# EAGLE design node3 (EAGLE 8.5.1)
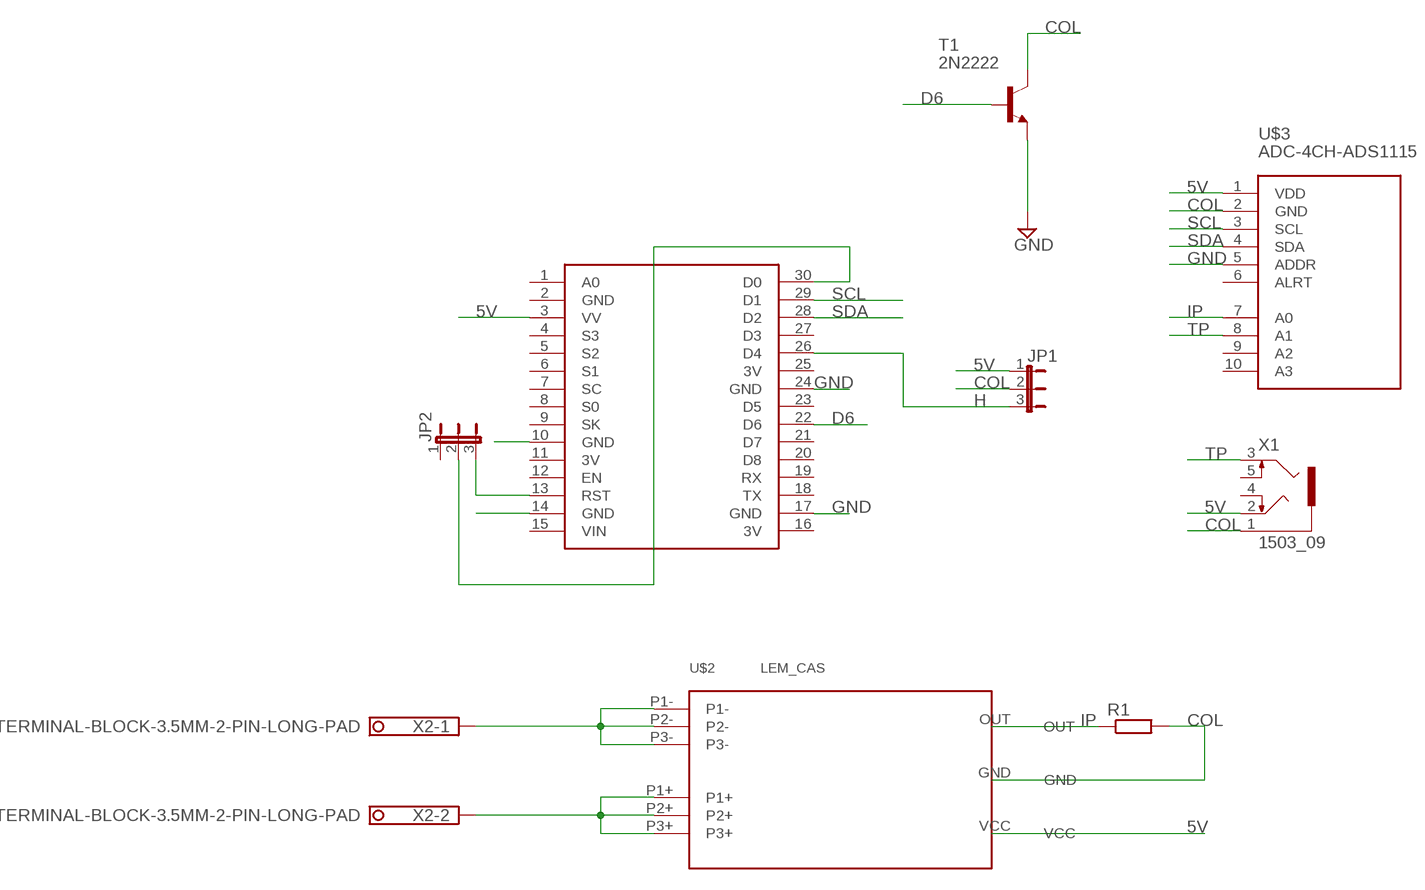
[diagram p0: schematic, sheet 1]

## Parts
JP1  JP2E  [JP2]
JP2  JP2E  [JP2]
R1  R-EU_0207/10  [0207/10]
T1  2N2222  [TO18]
U$1  NODEMCU  [NODEMCU]
U$2  LEM_CAS  [LEMCAS]
U$3  ADC-4CH-ADS1115  [ADC-4CH-ADS1115]
X1  1503_09  [1503_09]
X2  TERMINAL-BLOCK-3.5MM-2-PIN-LONG-PAD  [TERMINAL-BLOCK-2-PIN-3.5MM-LONG-PAD]

## Nets
5V: JP1.1 U$1.3(VV) U$2.VCC U$3.1(VDD) X1.2
COL: JP1.2 R1.2 T1.3(C) U$2.GND U$3.2(GND) X1.1
D6: T1.2(B) U$1.22(D6)
GND: T1.1(E) U$1.10(GND) U$1.14(GND) U$1.17(GND) U$1.24(GND) U$3.5(ADDR)
H: JP1.3 U$1.26(D4)
IN: U$2.P1- U$2.P2- U$2.P3- X2.1
IP: R1.1 U$2.OUT U$3.7(A0)
N$6: JP2.3 U$1.13(RST)
N$7: JP2.2 U$1.30(D0)
OUT: U$2.P1+ U$2.P2+ U$2.P3+ X2.2
SCL: U$1.29(D1) U$3.3(SCL)
SDA: U$1.28(D2) U$3.4(SDA)
TP: U$3.8(A1) X1.3
Unconnected: JP2.1 U$1.1(A0) U$1.4(S3) U$1.5(S2) U$1.6(S1) U$1.7(SC) U$1.8(S0) U$1.9(SK) U$1.12(EN) U$1.15(VIN) U$1.18(TX) U$1.19(RX) U$1.20(D8) U$1.21(D7) U$1.23(D5) U$1.27(D3) U$3.6(ALRT) U$3.9(A2) U$3.10(A3) X1.4 X1.5

## Power pins joined to a net without a drawn wire
3V: U$1.11(3V) U$1.16(3V) U$1.25(3V)
GND: U$1.2(GND)

## Library data of the parts
JP1 JP2 = jumper:JP2E: JUMPER
R1 = rcl:R-EU_: RESISTOR, European symbol; SPICEPREFIX: R
T1 = transistor:2N2222: NPN TRANSISTOR
U$1 = nodemcu:NODEMCU
U$2 = LEM_CAS:LEM_CAS
U$3 = diy-modules:ADC-4CH-ADS1115: 4 Channel 16-Bit Analog-to-Digital Converter based on ADS1115 chip Arduino ADS1115 Getting Started Tutorial is available here: http://henrysbench.capnfatz.com/henrys-bench/arduino-voltage-measurements/arduino-ads1115-module-getting-started-tutorial/ ADS1115 datasheet is available here: http://www.ti.com/lit/ds/symlink/ads1115.pdf Click here to find device on ebay.com <http://www.ebay.com/sch/ads1115+module>
X1 = con-lumberg:1503_09: Jack connectors according to JISC 6560, 3.5 mm Klinkeneinbaukupplung nach JISC 6560, 3,5 mm, 3-polig/ stereo, abgewinkelte Ausführung, mit 2 Öffnern und Lötaugen, für Leiterplatten Rückseitenmontage Source: http://www.lumberg.com/Produkte/PDFs/1503_09.pdf; OC_FARNELL: 1243244; OC_NEWARK: unknown
X2 = Rembrandt Electronics - Terminal Block 3-5mm v1-0:TERMINAL-BLOCK-3.5MM-2-PIN: Terminal Block 3.5mm Pitch: 3,5 mm Number of pins: 2 Created by Rembrandt Electronics www.rembrandtelectronics.com

## Board
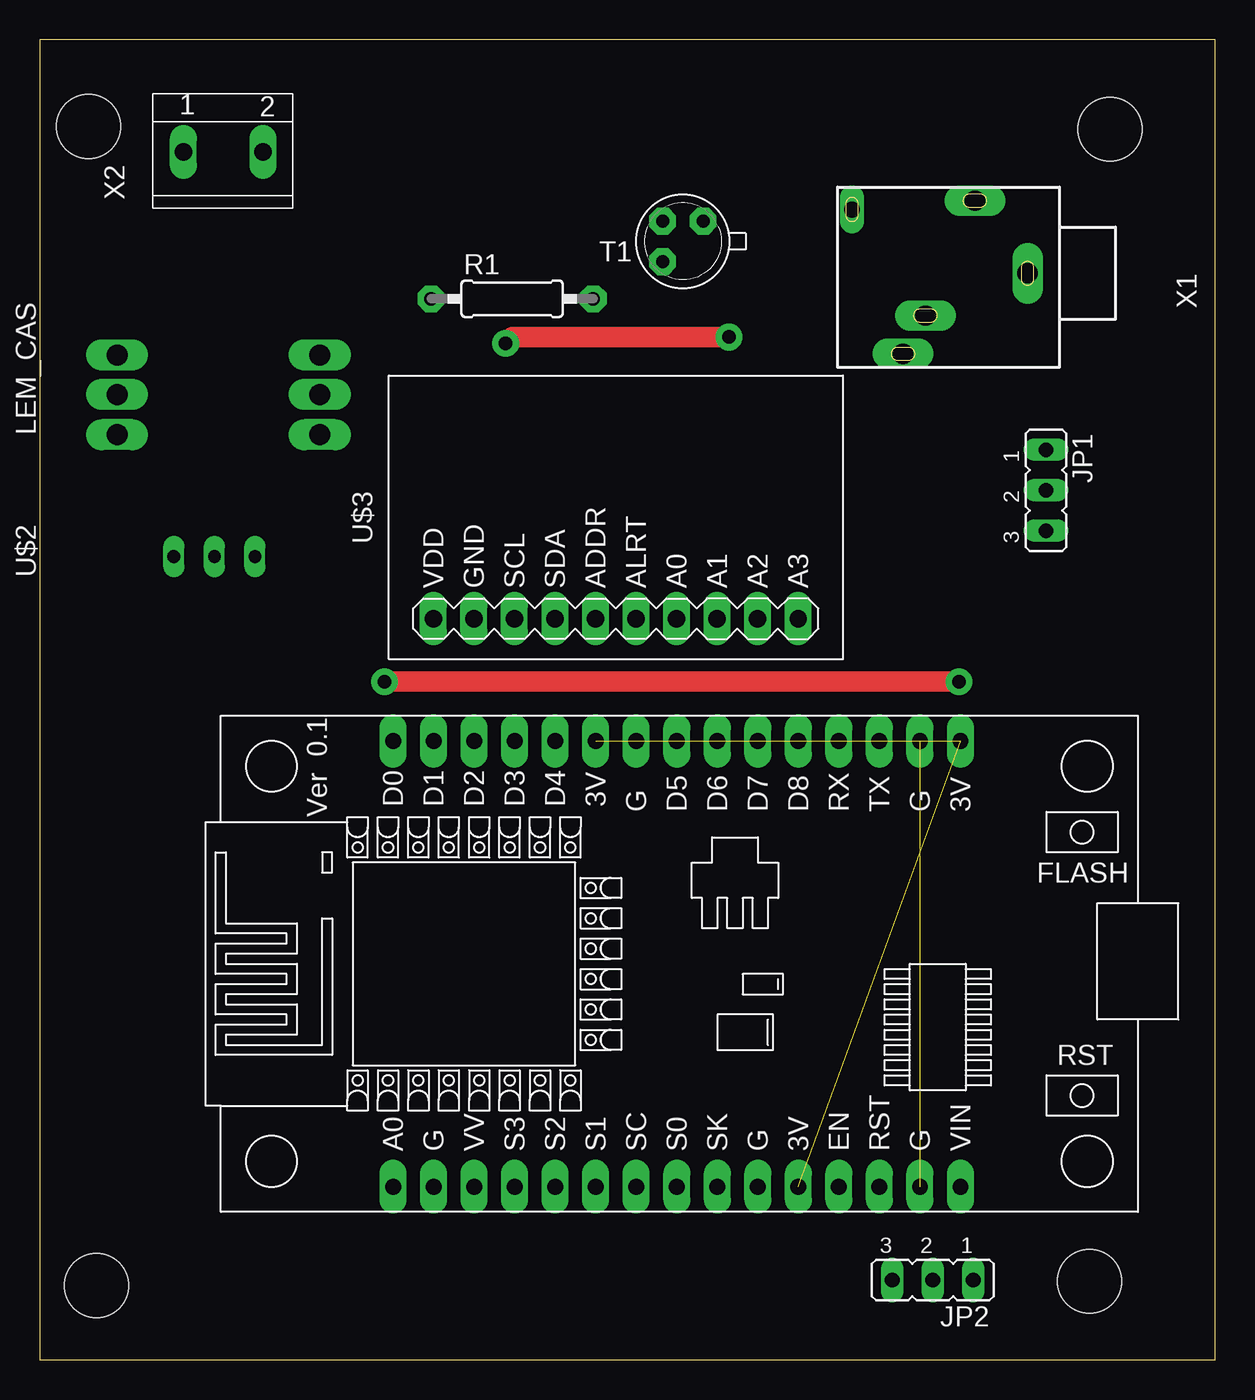
[diagram p1: board, top side]
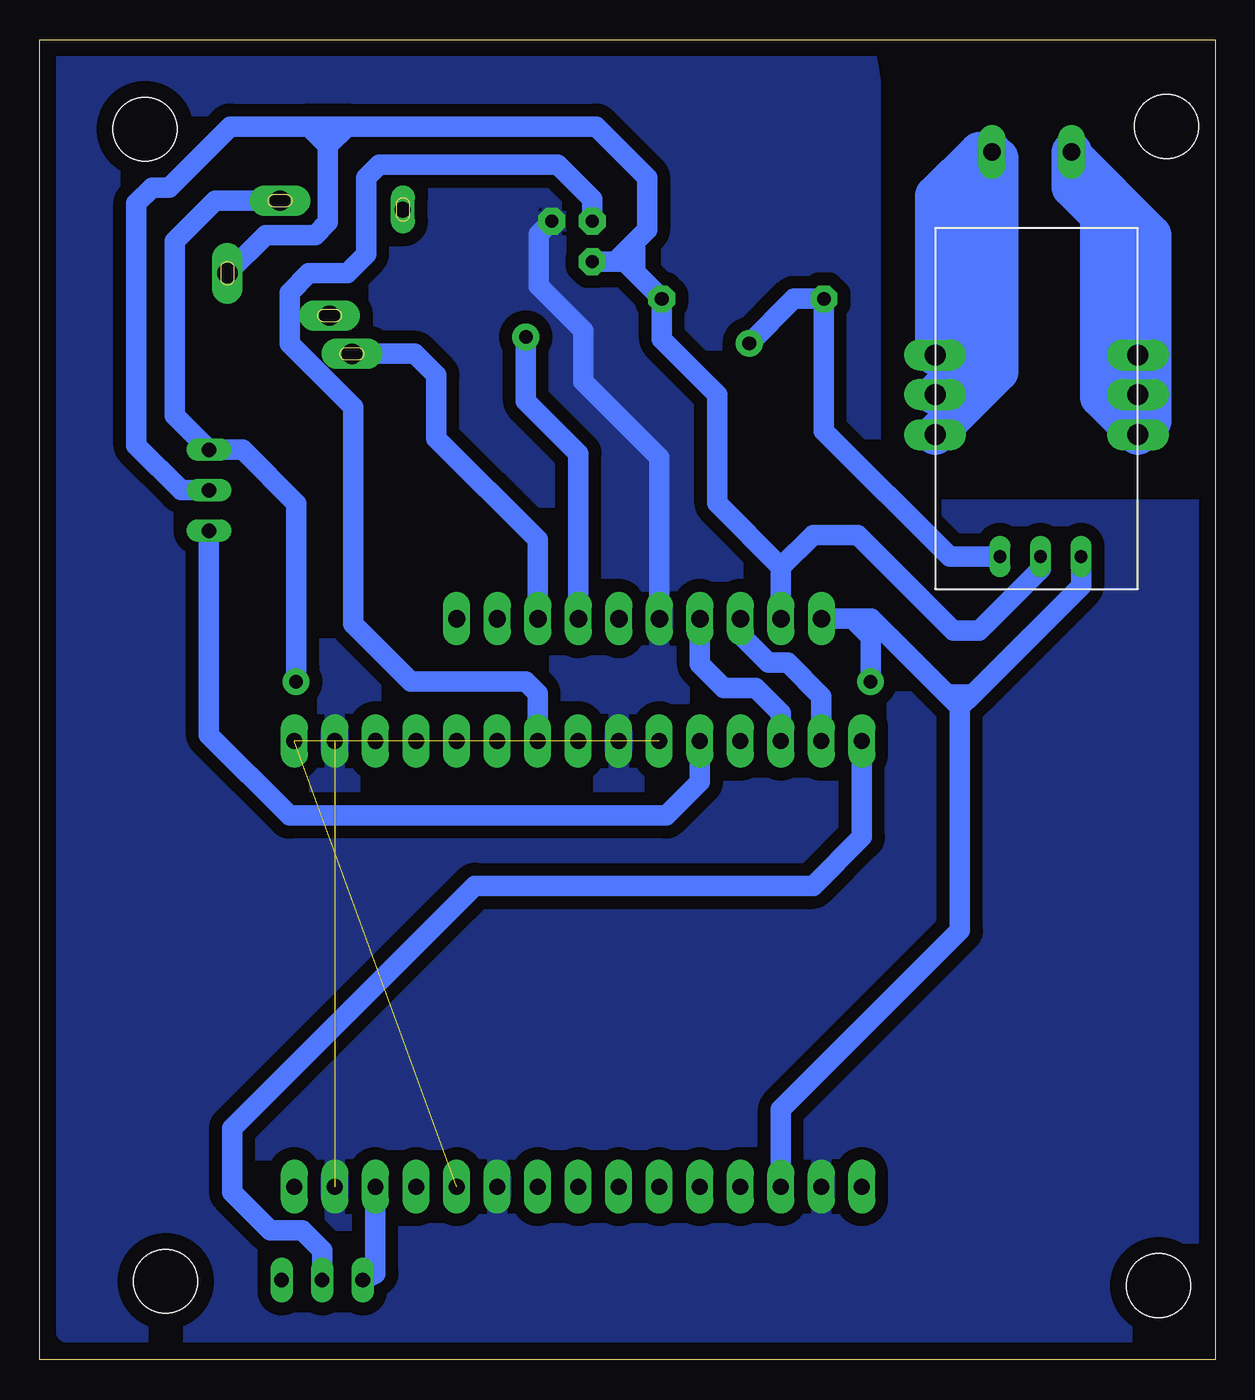
[diagram p2: board, bottom side, seen from below]

Size 73.64 x 82.73 mm. Coordinates in mm from the lower left corner, seen from the top.
Outline: 0,0 73.64,0 73.64,82.73 0,82.73 0,0
Copper layers (1*16): Top 0.035mm / dielectric 1.5mm / Bottom 0.035mm
Design rules "default": minimum track width 6mil, minimum drill 0.35mm, track to track 6mil, track to pad 6mil, pad to pad 6mil, via to via 6mil, smd to smd 6mil, copper to edge 40mil, drill to drill 6mil, minimum pad ring 10mil, minimum via ring 8mil, stop-mask expansion 4mil, vias tented up to drill 0mil, thermal gap 10mil
Holes 4 mm at 3.54,4.64 65.76,4.91 3.04,77.3 67.06,77.13

### Footprints (pad centres in the part's own frame; a part is rotated, then mirrored left to right if it is on the bottom)
JP2 = drill 0.914 long: 1 -2.54,0; 2 0,0; 3 2.54,0
0207/10 = drill 0.85 pad 1.676 octagon: 1 -5.08,0; 2 5.08,0
TO18 = drill 0.813 pad 1.676 octagon: 1 -1.27,-1.27; 2 1.27,-1.27; 3 1.27,1.27
NODEMCU = drill 1 pad 1.676 long: 1 -13.97,17.78; 2 -13.97,15.24; 3 -13.97,12.7; 4 -13.97,10.16; 5 -13.97,7.62; 6 -13.97,5.08; 7 -13.97,2.54; 8 -13.97,0; 9 -13.97,-2.54; 10 -13.97,-5.08; 11 -13.97,-7.62; 12 -13.97,-10.16; 13 -13.97,-12.7; 14 -13.97,-15.24; 15 -13.97,-17.78; 16 13.97,-17.78; 17 13.97,-15.24; 18 13.97,-12.7; 19 13.97,-10.16; 20 13.97,-7.62; 21 13.97,-5.08; 22 13.97,-2.54; 23 13.97,0; 24 13.97,2.54; 25 13.97,5.08; 26 13.97,7.62; 27 13.97,10.16; 28 13.97,12.7; 29 13.97,15.24; 30 13.97,17.78
LEMCAS = drill 0.8 pad 1.27 long: GND -10.16,0.254; OUT -10.16,-2.286; VCC -10.16,2.794 | drill 1.3 pad 1.93 long: P1+ -2.52,-6.35; P1- -2.52,6.35; P2+ 0,-6.35; P2- 0,6.35; P3+ 2.47,-6.35; P3- 2.47,6.35
ADC-4CH-ADS1115 = drill 1.092 pad 1.676 long: 1 -6.35,11.43; 2 -6.35,8.89; 3 -6.35,6.35; 4 -6.35,3.81; 5 -6.35,1.27; 6 -6.35,-1.27; 7 -6.35,-3.81; 8 -6.35,-6.35; 9 -6.35,-8.89; 10 -6.35,-11.43
1503_09 = drill 1.27 pad 1.422 long: 1 0,-2.1; 2 -4.55,-5.4; 3 5.05,-9.9; 5 2.65,-8.5 | drill 1 pad 1.016 long: 4 -4,-13.1
TERMINAL-BLOCK-2-PIN-3.5MM-LONG-PAD = drill 1.1 pad 1.7 long: 1 -5,0; 2 0,0

### Placement (x,y rotation side)
JP1  63.05,54.5 270 top
JP2  55.95,4.99 180 top
R1  29.59,66.5 0 top
T1  40.29,70.1 180 top
U$1  39.91,24.81 90 top
U$2  11.19,60.5 90 top
U$3  36.09,52.8 90 top
X1  63.99,68.1 270 top
X2  13.99,75.7 0 top

### Tracks (layer width: path | path; a pad name or v marks a point on that pad's centre or on a via)
3V  (2 unrouted)
5V  (via drill 0.85 pad 1.68)
  Top 1.27: v21.59,42.5 v57.59,42.5
  Bottom 1.27: U$1.3 27.21,15.68 15.99,26.9 15.99,40.9 | 21.54,46.45 22.74,46.45 | 22.74,46.45 U$3.1 | 15.99,40.9 16.79,41.7 | 16.79,41.7 21.54,46.45 | X1.2 62.64,72.65 65.19,70.1 65.19,59.18 JP1.1 60.93,57.04 57.56,53.67 57.56,43.3 57.59,43.27 v57.59,42.5 | U$2.VCC 8.4,48.49 15.19,41.7 | 15.19,41.7 15.99,40.9 | 15.19,41.7 16.79,41.7 | v21.59,42.5 21.59,45.3 | 21.59,45.3 21.59,46.4 21.54,46.45 | 21.59,45.3 22.74,46.45
COL
  Bottom 1.27: 36.33,68.16 R1.2 34.67,63.98 31.19,60.5 31.19,53.68 27.2,49.69 | 36.33,68.16 37,68.83 37.59,68.83 | 37.59,68.83 T1.3 | JP1.2 64.79,54.5 67.59,57.3 67.59,72.5 66.61,73.48 65.55,73.48 61.73,77.3 56.79,77.3 | 56.79,77.3 55.59,77.3 | 55.59,77.3 54.39,77.3 | 54.39,77.3 38.79,77.3 35.59,74.1 35.59,70.83 36.55,69.86 | 36.55,69.86 37.59,68.83 | 36.33,68.16 36.33,69.64 36.55,69.86 | X1.1 59.49,70.5 56.39,70.5 55.59,71.3 55.59,76.1 | 55.59,76.1 55.59,77.3 | 54.39,77.3 55.59,76.1 | 55.59,76.1 56.79,77.3 | U$2.GND 10.94,49.55 14.79,45.7 16.39,45.7 22.39,51.7 25.19,51.7 27.2,49.69 | 27.2,49.69 U$3.2
D6
  Bottom 1.27: U$1.22 42.45,41.76 43.19,42.5 50.39,42.5 53.99,46.1 53.99,59.7 57.99,63.7 57.99,66.9 56.79,68.1 54.39,68.1 53.19,69.3 53.19,74.1 52.39,74.9 41.19,74.9 39.02,72.73 T1.2
GND  (2 unrouted)
  Bottom 1.27: U$3.5 34.82,56.53 39.59,61.3 39.59,64.5 42.39,67.3 42.39,70.54 T1.1
  pour Bottom (isolate 0.813): -0.01,1.7 71.99,1.7 73.19,82.1 21.99,82.5 21.59,80.1 21.59,54.5 20.39,53.3 0.79,53.3 0.79,2.5
H
  Bottom 1.27: U$1.26 32.29,36.2 34.39,34.1 57.99,34.1 63.05,39.16 JP1.3
IN
  Bottom 2.54: X2.1 8.99,75.1 4.84,70.95 U$2.P3- | X2.1 8.99,73.5 7.19,71.7 7.19,62.5 | 7.19,62.5 7.19,60.33 U$2.P1- 3.99,58.83 3.99,61.35 | 3.99,61.35 U$2.P2- 6.39,62.05 6.39,62.1 6.79,62.5 7.19,62.5 | 3.99,61.35 3.99,70.5 8.99,75.5 X2.1
IP  (via drill 0.85 pad 1.68)
  Top 1.27: v43.19,64.1 29.59,64.1 v29.19,63.7
  Bottom 1.27: U$2.OUT 16.63,50.34 24.51,58.22 R1.1 26.39,66.5 v29.19,63.7 | U$3.7 39.9,56.81 43.19,60.1 v43.19,64.1
N$6
  Bottom 1.27: JP2.3 52.61,5.39 U$1.13
N$7
  Bottom 1.27: JP2.2 55.95,6.86 57.19,8.1 59.19,8.1 61.59,10.5 61.59,14.5 46.39,29.7 25.19,29.7 22.13,32.76 U$1.30
OUT
  Bottom 2.54: U$2.P1+ 13.59,61.93 13.59,75.3 | 13.59,75.3 X2.2 | U$2.P3+ 17.54,72.95 14.79,75.7 14.39,75.3 13.59,75.3 | U$2.P2+ 15.19,62.85 15.19,73.7 13.59,75.3
SCL
  Bottom 1.27: U$1.29 24.67,41.58 26.79,43.7 27.99,43.7 29.74,45.45 U$3.3
SDA
  Bottom 1.27: U$1.28 27.21,40.52 28.79,42.1 30.79,42.1 32.28,43.59 U$3.4
TP
  Bottom 1.27: U$3.8 42.44,51.4 48.79,57.75 48.79,61.7 50.14,63.05 X1.3